# EAGLE design lightcontrol (EAGLE 5.10)
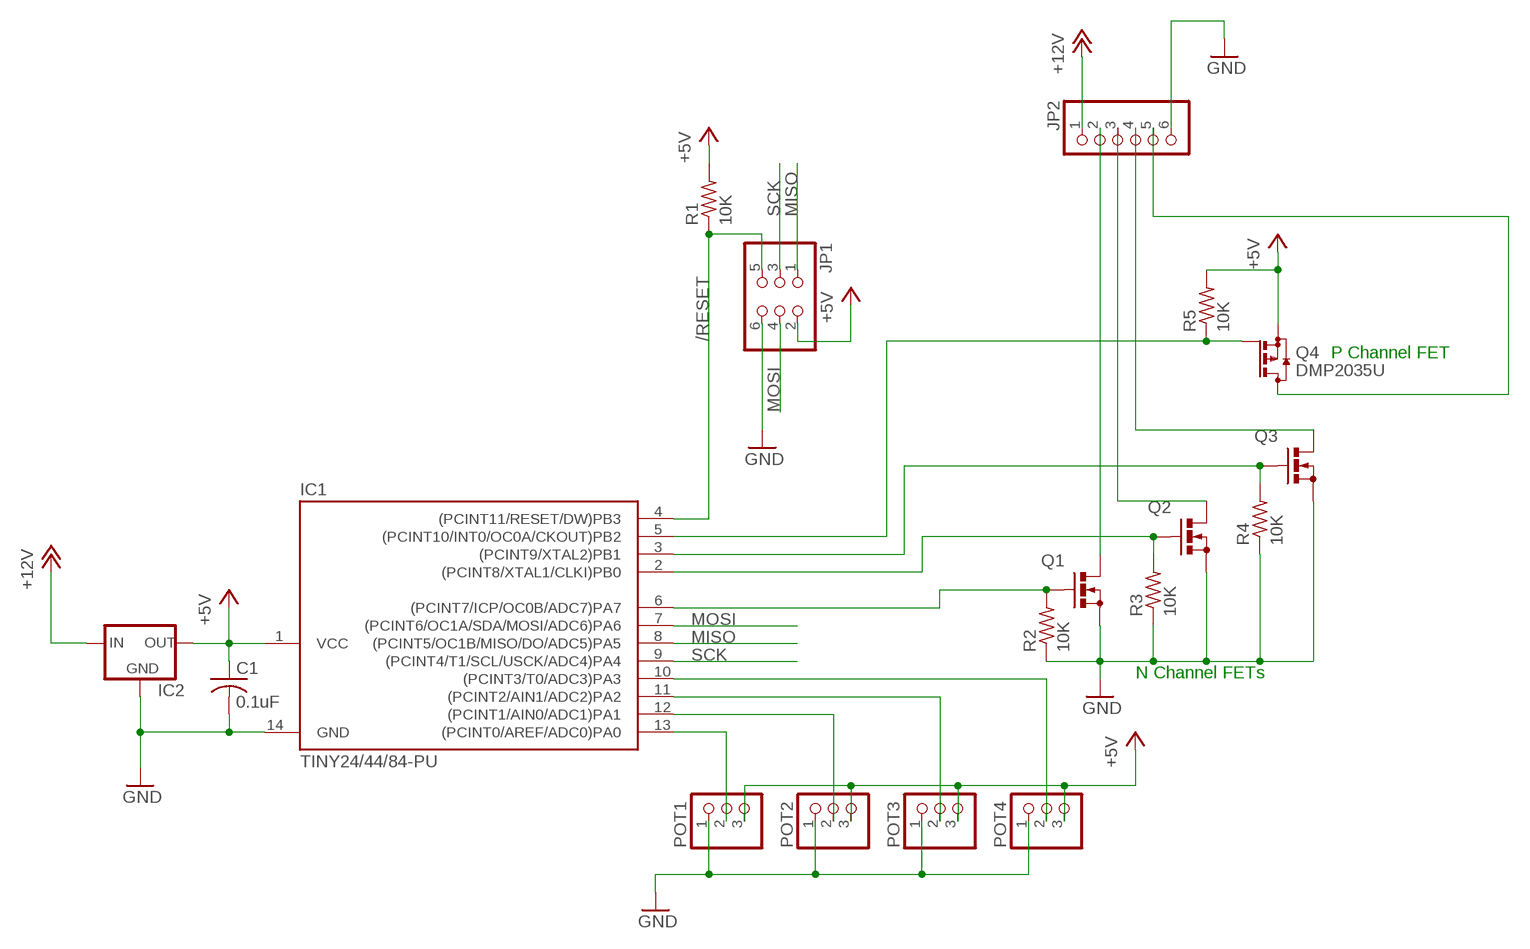
[diagram p0: schematic, sheet 1]

## Parts
C1  0.1uF  C-US050-035X075  [C050-035X075]
IC1  TINY24/44/84-PU  [DIL14]
IC2  V_REG_78XX-TO-220  [TO-220-ALT]
JP1  PINHD-2X3  [2X03]
JP2  PINHD-1X6/90  [1X06/90]
POT1  PINHD-1X3  [1X03]
POT2  PINHD-1X3  [1X03]
POT3  PINHD-1X3  [1X03]
POT4  PINHD-1X3  [1X03]
Q1  BS170  [SOT54E]
Q2  BS170  [SOT54E]
Q3  BS170  [SOT54E]
Q4  DMP2035U  BSS84  [SOT23]
R1  10K  R-US_0204/5  [0204/5]
R2  10K  R-US_0204/5  [0204/5]
R3  10K  R-US_0204/5  [0204/5]
R4  10K  R-US_0204/5  [0204/5]
R5  10K  R-US_0204/5  [0204/5]

## Nets
+5V [power]: C1.1 IC1.1(VCC) IC2.OUT JP1.2 POT1.3 POT2.3 POT3.3 POT4.3 Q4.2(S) R1.2 R5.2
+12V [power]: IC2.IN JP2.1
/RESET: IC1.4((PCINT11/RESET/DW)PB3) JP1.5 R1.1
GND: C1.2 IC1.14(GND) IC2.GND JP1.6 JP2.6 POT1.1 POT2.1 POT3.1 POT4.1 Q1.S Q2.S Q3.S R2.1 R3.1 R4.1
MISO: IC1.8((PCINT5/OC1B/MISO/DO/ADC5)PA5) JP1.1
MOSI: IC1.7((PCINT6/OC1A/SDA/MOSI/ADC6)PA6) JP1.4
N$1: IC1.13((PCINT0/AREF/ADC0)PA0) POT1.2
N$2: IC1.12((PCINT1/AIN0/ADC1)PA1) POT2.2
N$3: IC1.11((PCINT2/AIN1/ADC2)PA2) POT3.2
N$4: IC1.10((PCINT3/T0/ADC3)PA3) POT4.2
N$5 [power]: JP2.2 Q1.D
N$6: IC1.6((PCINT7/ICP/OC0B/ADC7)PA7) Q1.G R2.2
N$7 [power]: JP2.3 Q2.D
N$9: IC1.3((PCINT9/XTAL2)PB1) Q3.G R4.2
N$10: IC1.2((PCINT8/XTAL1/CLKI)PB0) Q2.G R3.2
N$11 [power]: JP2.4 Q3.D
N$12 [power]: JP2.5 Q4.3(D)
N$13: IC1.5((PCINT10/INT0/OC0A/CKOUT)PB2) Q4.1(G) R5.1
SCK: IC1.9((PCINT4/T1/SCL/USCK/ADC4)PA4) JP1.3

## Notes on the sheet
- P Channel FET
- N Channel FETs

## Library data of the parts
C1 = rcl:C-US: CAPACITOR, American symbol
IC1 = avr-4:TINY24/44/84
IC2 = SparkFun:V_REG_78XX: Voltage Regulator Standard 7805 5V regulator. IGO (Input Ground Output). Spark Fun Electronics SKU : COM-00107
JP1 = pinhead:PINHD-2X3: PIN HEADER
JP2 = pinhead:PINHD-1X6: PIN HEADER
POT1-POT4 = pinhead:PINHD-1X3: PIN HEADER
Q1-Q3 = transistor-small-signal:BS170: N-CHANNEL MOS FET
Q4 = transistor-small-signal:BSS84: P-CHANNEL MOS FET
R1-R5 = rcl:R-US_: RESISTOR, American symbol

## Net classes
1 power: width 0.381 mm

## Board
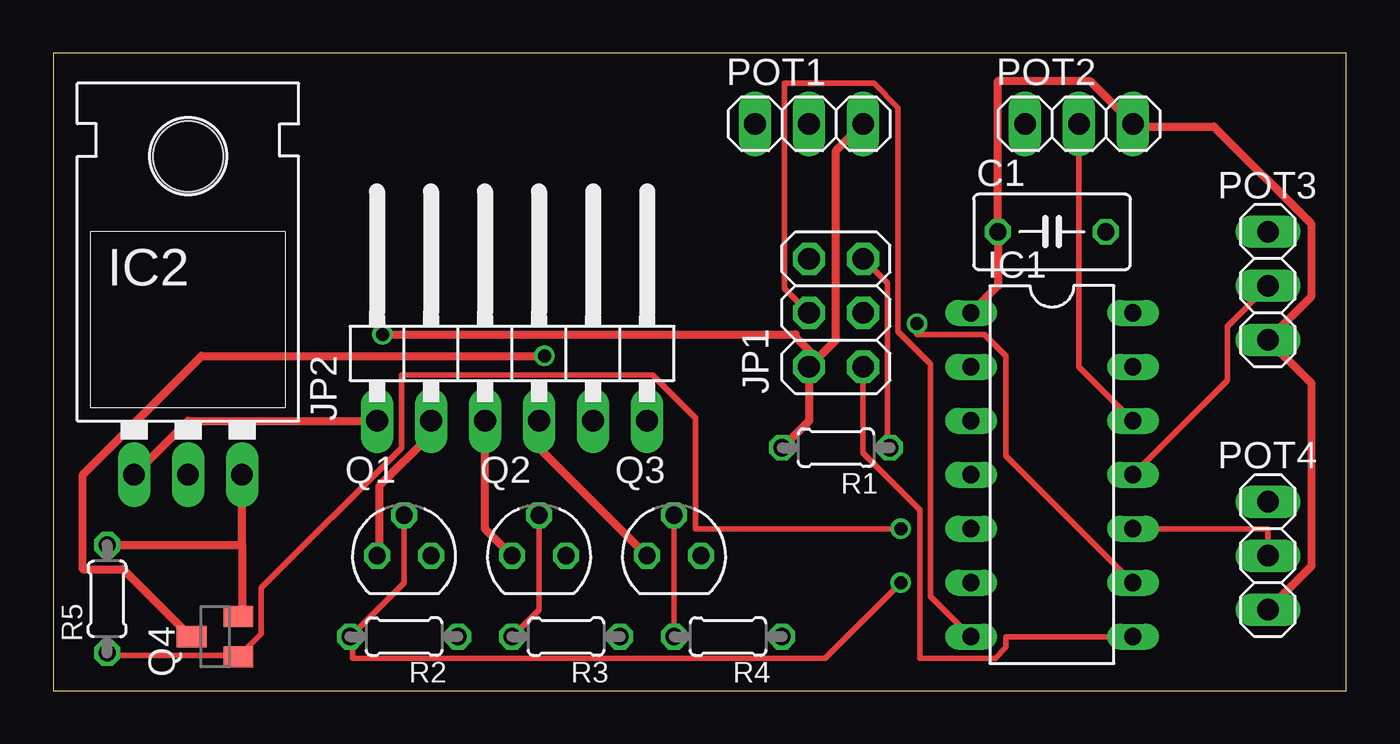
[diagram p1: board, top side]
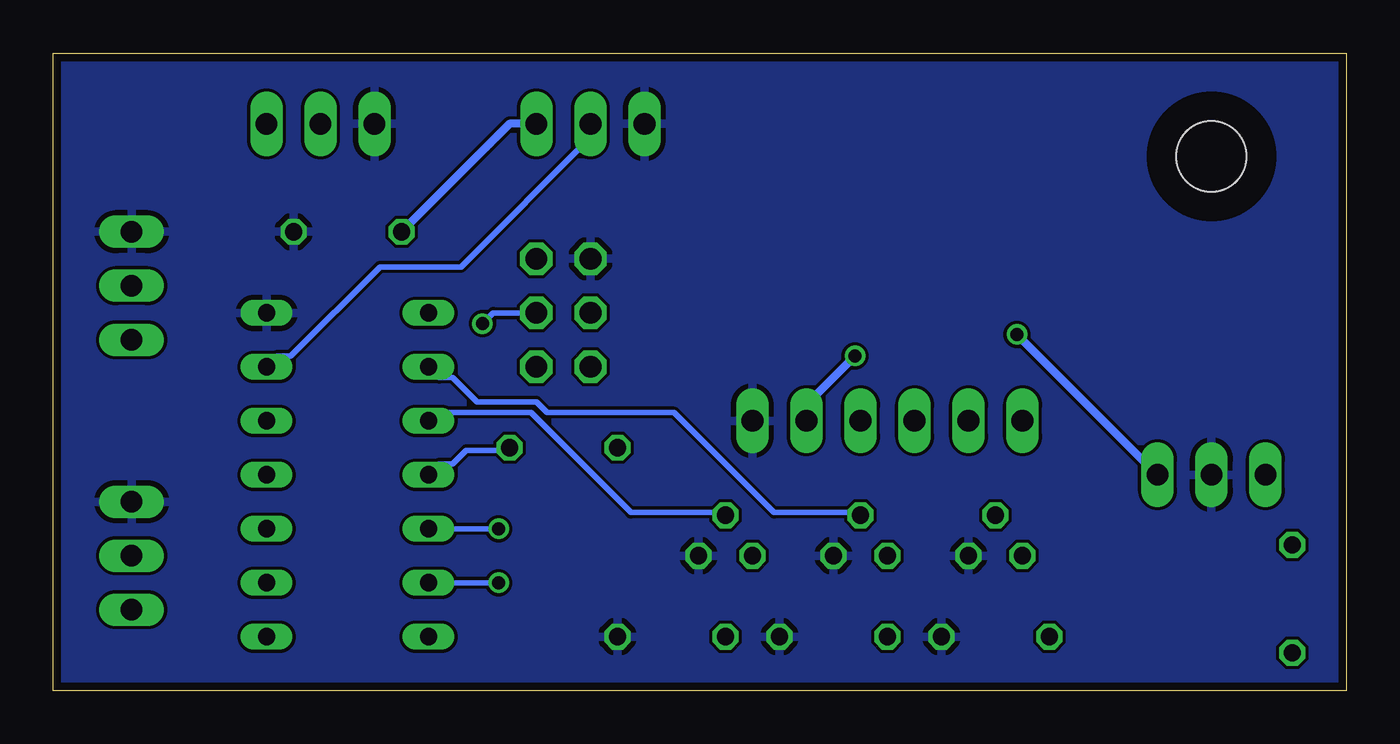
[diagram p2: board, bottom side, seen from below]

Size 60.84 x 30 mm. Coordinates in mm from the lower left corner, seen from the top.
Outline: 0,0 60.84,0 60.84,30 0,30 0,0
Copper layers (1*16): Top 0.0356mm / dielectric 1.5011mm / Bottom 0.0356mm
Design rules "LaenPCBOrder": minimum track width 6mil, minimum drill 13mil, track to track 6mil, track to pad 6mil, pad to pad 6mil, via to via 6mil, smd to smd 6mil, copper to edge 15mil, drill to drill 6mil, minimum pad ring 7mil, minimum via ring 7mil, stop-mask expansion 3mil, vias tented up to drill 0mil, thermal gap 10mil

### Footprints (pad centres in the part's own frame; a part is rotated, then mirrored left to right if it is on the bottom)
C050-035X075 = drill 0.813 octagon: 1 -2.54,0; 2 2.54,0
DIL14 = drill 0.813 long: 1 -7.62,-3.81; 2 -5.08,-3.81; 3 -2.54,-3.81; 4 0,-3.81; 5 2.54,-3.81; 6 5.08,-3.81; 7 7.62,-3.81; 8 7.62,3.81; 9 5.08,3.81; 10 2.54,3.81; 11 0,3.81; 12 -2.54,3.81; 13 -5.08,3.81; 14 -7.62,3.81
TO-220-ALT = drill 1.016 long: GND 0,-3.81; IN -2.54,-3.81; OUT 2.54,-3.81 | hole 3.302: 0,11.176
2X03 = drill 1.016 octagon: 1 -2.54,-1.27; 2 -2.54,1.27; 3 0,-1.27; 4 0,1.27; 5 2.54,-1.27; 6 2.54,1.27
1X06/90 = drill 1.016 long: 1 -6.35,-3.81; 2 -3.81,-3.81; 3 -1.27,-3.81; 4 1.27,-3.81; 5 3.81,-3.81; 6 6.35,-3.81
1X03 = drill 1.016 long: 1 -2.54,0; 2 0,0; 3 2.54,0
SOT54E = drill 0.813 octagon: D -1.27,0; G 0,1.905; S 1.27,0
SOT23 = smd 1 x 1.4: 1 -0.95,-1.1; 2 0.95,-1.1; 3 0,1.1
0204/5 = drill 0.813 octagon: 1 -2.54,0; 2 2.54,0

### Placement (x,y rotation side)
C1  46.99,21.59 0 top
IC1  46.99,10.16 270 top
IC2  6.35,13.97 0 top
JP1  36.83,17.78 90 top
JP2  21.59,16.51 0 top
POT1  35.56,26.67 0 top
POT2  48.26,26.67 0 top
POT3  57.15,19.05 270 top
POT4  57.15,6.35 270 top
Q1  16.51,6.35 0 top
Q2  22.86,6.35 0 top
Q3  29.21,6.35 0 top
Q4  7.62,2.54 90 top
R1  36.83,11.43 180 top
R2  16.51,2.54 180 top
R3  24.13,2.54 180 top
R4  31.75,2.54 180 top
R5  2.54,4.32 90 top

### Tracks (layer width: path | path; a pad name or v marks a point on that pad's centre or on a via)
+5V  (via drill 0.61)
  Top 0.381: POT4.3 59.18,5.84 59.18,14.48 POT3.3 59.18,18.54 59.18,21.97 54.61,26.54 50.93,26.54 POT2.3 48.77,28.7 44.45,28.7 C1.1 44.45,19.05 IC1.1 | 8.89,6.86 IC2.OUT | 8.89,6.86 8.89,3.68 8.76,3.56 Q4.2 | R5.2 8.89,6.86 | R1.2 35.56,12.7 JP1.2 | POT1.3 36.83,25.4 36.83,16.51 JP1.2 | v15.49,16.76 34.92,16.76 34.92,16.64 35.81,15.75 JP1.2
  Bottom 0.381: IC2.OUT v15.49,16.76 | C1.1 39.37,26.67 POT1.3
+12V
  Top 0.381: IC2.IN 6.35,12.7 JP2.1
/RESET
  Top 0.254: R1.1 39.24,11.56 39.24,19.18 JP1.5
  Bottom 0.254: IC1.4 42.67,10.67 42.04,10.67 41.4,11.3 39.5,11.3 R1.1
GND
  pour Bottom: -0.25,30.23 61.21,30.23 61.21,-0.25 -0.25,-0.25
MISO
  Top 0.254: IC1.8 44.83,2.54 44.83,2.03 44.32,1.52 40.77,1.52 40.77,8.51 38.1,11.18 JP1.1
MOSI
  Top 0.254: IC1.7 41.27,4.45 41.27,15.37 39.75,16.89 39.75,27.43 38.61,28.57 34.42,28.57 34.42,18.92 JP1.4
N$1
  Bottom 0.254: IC1.13 50.29,15.75 49.66,15.75 45.47,19.94 41.66,19.94 35.56,26.04 POT1.2
N$2
  Top 0.254: IC1.12 48.26,15.24 POT2.2
N$3
  Top 0.254: IC1.11 55.24,14.61 55.24,17.14 POT3.2
N$4
  Top 0.254: IC1.10 57.15,7.62 POT4.2
N$5
  Top 0.381: Q1.D 15.37,6.48 15.37,9.65 17.78,12.06 JP2.2
N$6  (via drill 0.61)
  Top 0.254: Q1.G 16.51,5.08 R2.2 14.1,2.54 14.1,1.52 36.32,1.52 v39.88,5.08
  Bottom 0.254: v39.88,5.08 IC1.6
N$7
  Top 0.381: Q2.D 20.32,7.62 JP2.3
N$9
  Top 0.254: R4.2 Q3.G
  Bottom 0.254: IC1.3 42.8,13.08 38.35,13.08 33.66,8.38 29.34,8.38 Q3.G
N$10
  Top 0.254: R3.2 22.86,3.81 Q2.G
  Bottom 0.254: IC1.2 42.67,14.73 42.04,14.73 40.89,13.59 38.1,13.59 37.59,13.08 31.62,13.08 26.92,8.38 22.99,8.38 Q2.G
N$11
  Top 0.381: Q3.D 22.86,11.43 JP2.4
N$12  (via drill 0.61)
  Top 0.381: v23.11,15.75 6.99,15.75 1.4,10.16 1.4,5.71 3.3,5.71 6.48,2.54 Q4.3
  Bottom 0.381: v23.11,15.75 25.4,13.46 JP2.5
N$13  (via drill 0.61)
  Top 0.254: R5.1 2.54,1.65 8.64,1.65 Q4.1 8.76,1.65 9.78,2.67 9.78,4.83 16.38,11.43 16.38,14.86 28.19,14.86 30.23,12.83 30.23,7.62 v39.88,7.62
  Bottom 0.254: v39.88,7.62 IC1.5
SCK  (via drill 0.61)
  Top 0.254: IC1.9 44.83,11.05 44.83,15.75 43.81,16.76 40.64,16.76 v40.64,17.27
  Bottom 0.254: v40.64,17.27 40.13,17.78 JP1.3

### Text on the board
tDocu: Lectrobox DIODER Controller++ | 1 | 1 | 1 | 1 | 1 | 1